# EasyEDA schematic SCH_MusicTheoryLesson-CI-TT_2024-12-17.json
TITLE: Sheet_1; REV: 1.0; Date: 2024-11-09; Sheet: 1/1; Drawn By: akhil.arp2019; Company: Your Company
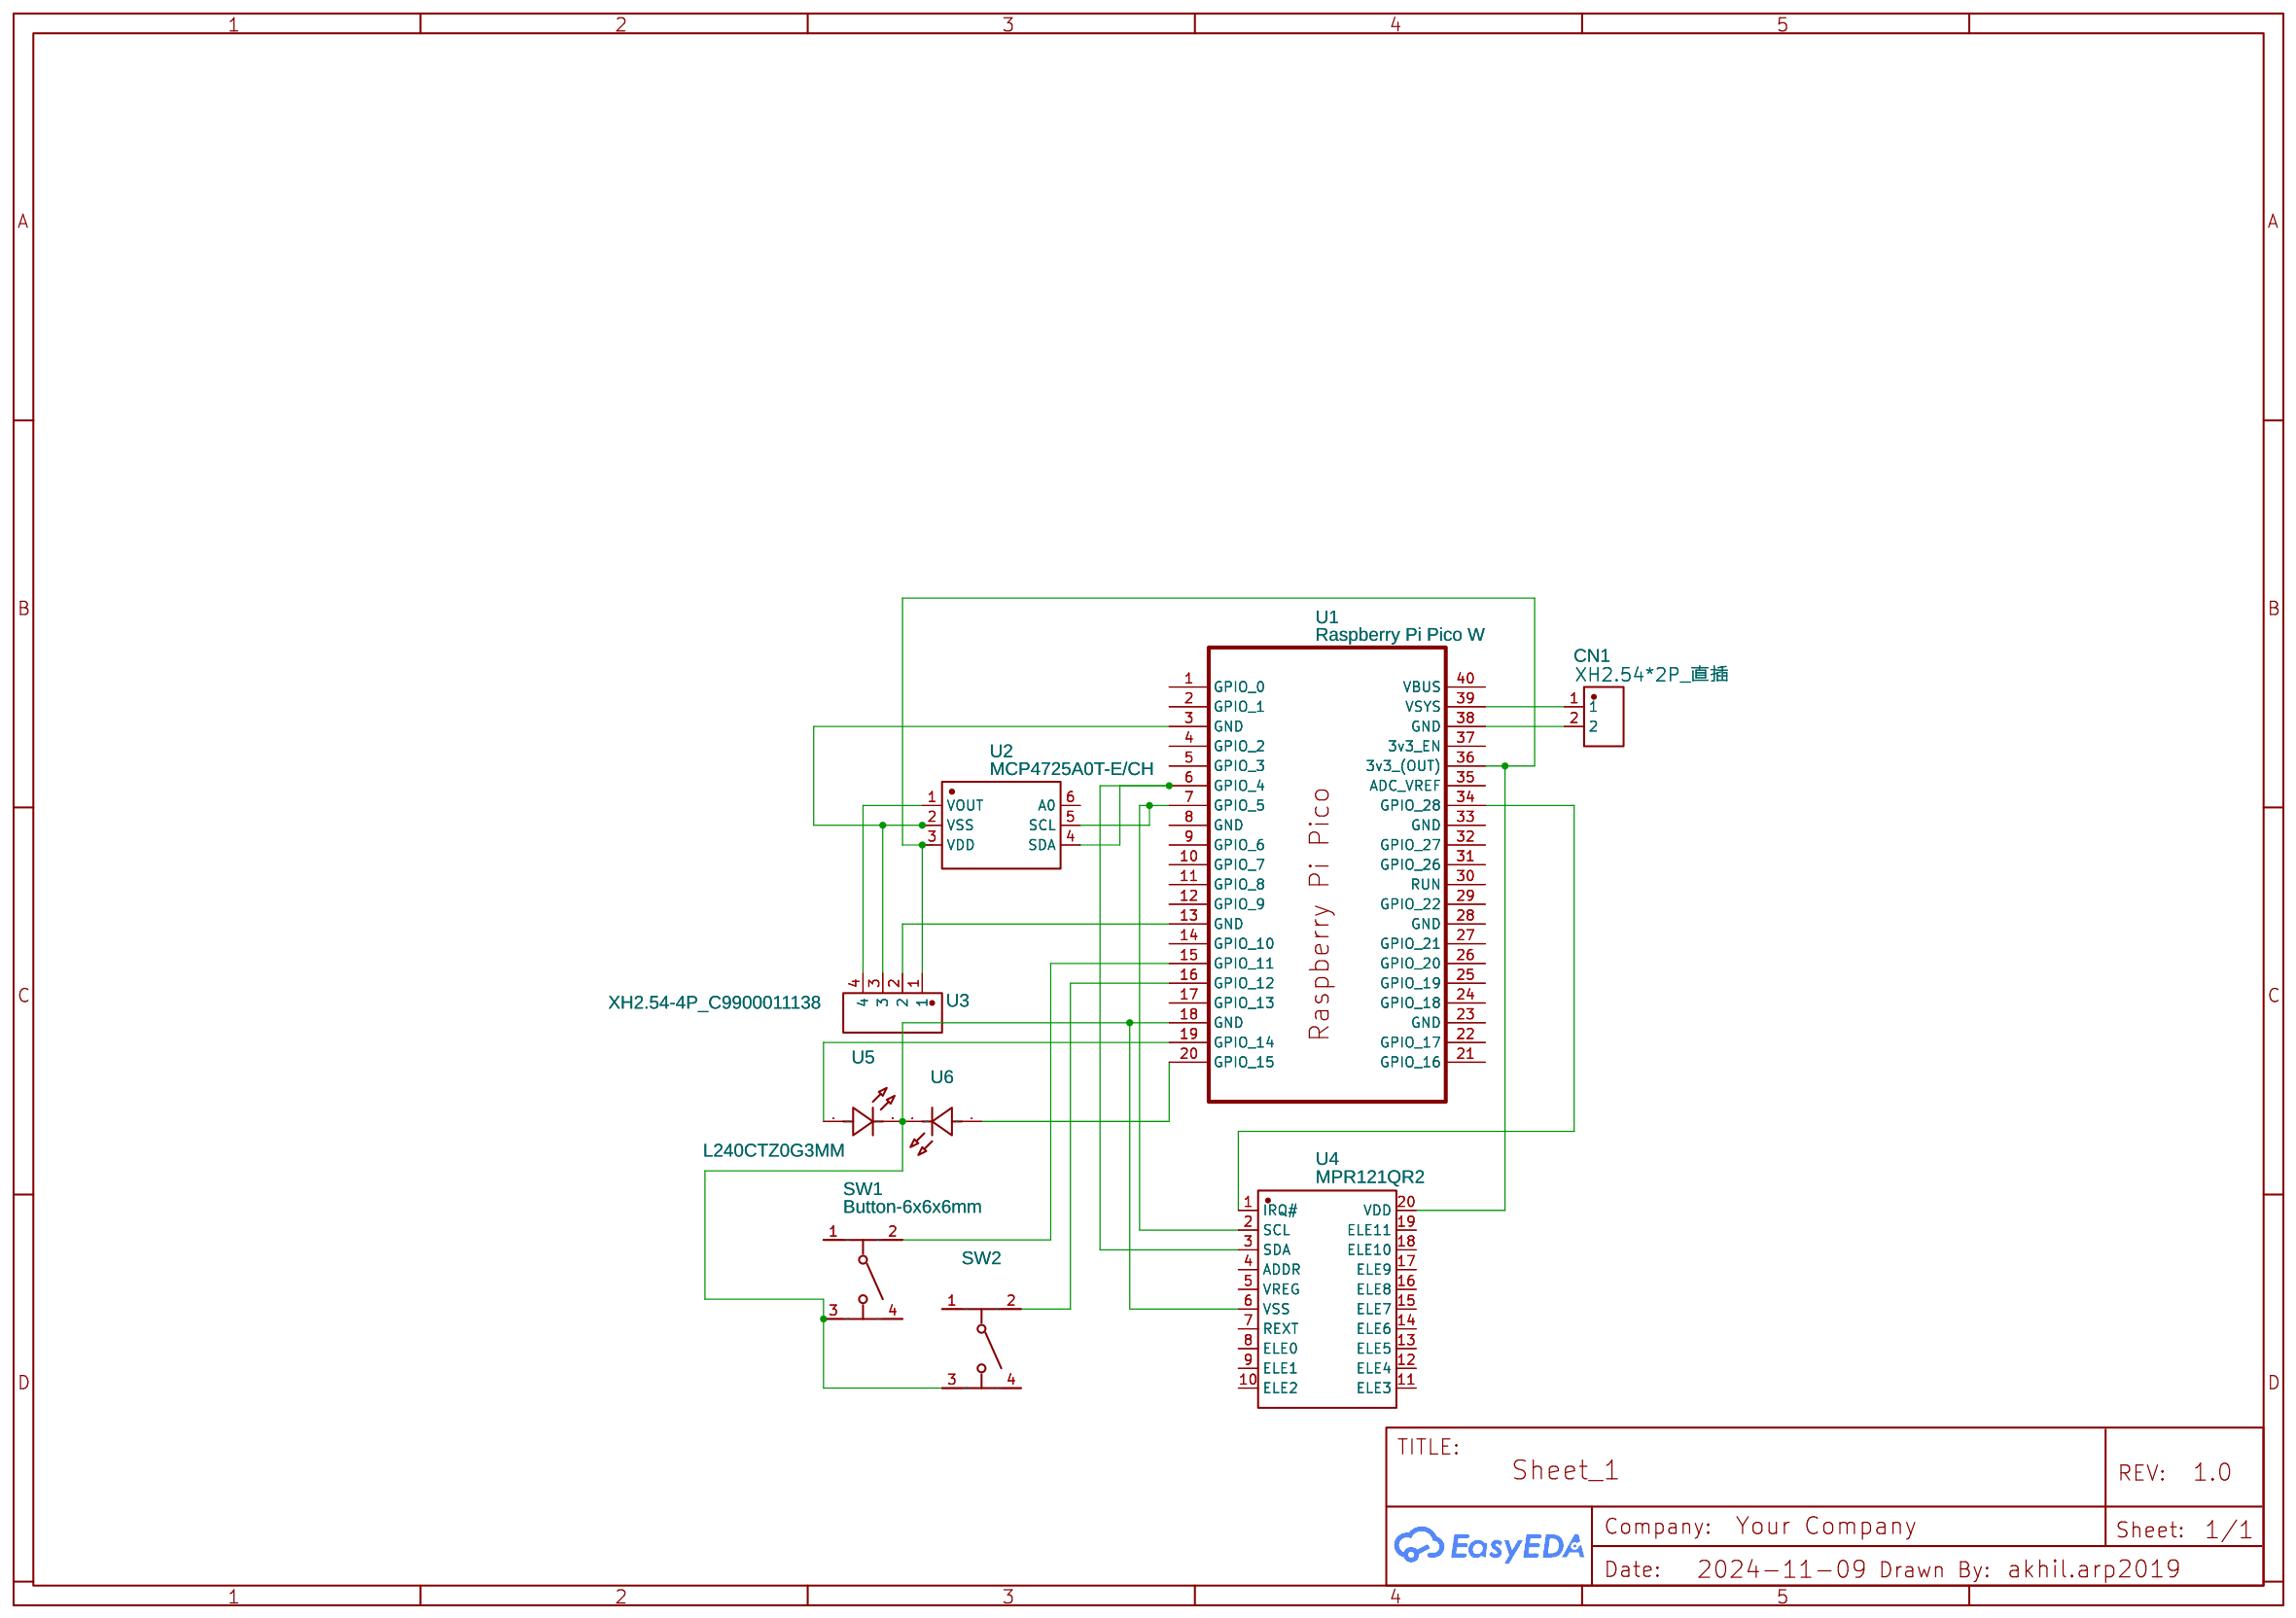
[diagram p0: schematic sheet]

## Parts
CN1  XH2.54*2P_直插  [CONN-TH_2P-P2.50-XH2.54-2P]
SW1  Button-6x6x6mm  [SW-TH_4P-L6.0-W6.0-P4.50-LS6.1]
SW2  Button-6x6x6mm  [SW-TH_4P-L6.0-W6.0-P4.50-LS6.1]
U1  Raspberry Pi Pico W  [RASPBERRY PI PICO/ RASPBERRY PI PICO W]
U2  MCP4725A0T-E/CH  [SOT-23-6_L2.9-W1.6-P0.95-LS2.8-BL]
U3  XH2.54-4P_C9900011138  [CONN-TH_XH2.54-4P]
U4  MPR121QR2  [QFN-20_L3.0-W3.0-P0.40-BL]
U5  L240CTZ0G3MM  [LED-TH_BD3.8-P2.54_L240CTZ0G3MM]
U6  L240CTZ0G3MM  [LED-TH_BD3.8-P2.54_L240CTZ0G3MM]

## Library data of the parts
CN1 = XH2.54*2P_直插: Contributor: LCSC; Supplier: LCSC; Supplier Part: C9900008615; Manufacturer: null; JLCPCB Part Class: Extended Part
SW1 SW2 = Button-6x6x6mm: Supplier Part: C71836; Supplier: LCSC; Manufacturer: BBJ; Manufacturer Part: Switch,6*6*6Plastic head,260G, 0.25mm,Straight line
U1 = Raspberry Pi Pico W: Contributor: benkors
U2 = MCP4725A0T-E/CH: Contributor: LCSC; Supplier: LCSC; Manufacturer: MICROCHIP(美国微芯); Supplier Part: C144198; JLCPCB Part Class: Extended Part
U3 = XH2.54-4P_C9900011138: Contributor: LCSC; Supplier: LCSC; Supplier Part: C9900011138; Manufacturer: null; Manufacturer Part: XH2.54-4P; JLCPCB Part Class: Extended Part
U4 = MPR121QR2: Contributor: LCSC; Supplier: LCSC; Supplier Part: C91322; Manufacturer: NXP(恩智浦); JLCPCB Part Class: Extended Part
U5 U6 = L240CTZ0G3MM: Supplier: LCSC; Supplier Part: C9900093286; Manufacturer: null; Contributor: lcsc; JLCPCB Part Class: Extended Part

## Nets
Net-(CN1-1): CN1.1 U1.39(VSYS)
Net-(CN1-2): CN1.2 U1.38(GND)
Net-(SW1-2): SW1.2 U1.15(GPIO 11)
Net-(SW1-3): SW1.3 SW2.3 U1.18(GND) U4.6(VSS) U5.2(K) U6.2(K)
Net-(SW2-2): SW2.2 U1.16(GPIO 12)
Net-(U1-3): U1.3(GND) U2.2(VSS) U3.3
Net-(U1-6): U1.6(GPIO 4) U2.4(SDA) U4.3(SDA)
Net-(U1-7): U1.7(GPIO 5) U2.5(SCL) U4.2(SCL)
Net-(U1-13): U1.13(GND) U3.2
Net-(U1-19): U1.19(GPIO 14) U5.1(A)
Net-(U1-20): U1.20(GPIO 15) U6.1(A)
Net-(U1-34): U1.34(GPIO 28) U4.1(IRQ#)
Net-(U1-36): U1.36(3v3 (OUT)) U2.3(VDD) U3.1 U4.20(VDD)
Net-(U2-1): U2.1(VOUT) U3.4

Not connected (* = marked no-connect by the designer): SW1 1 4; SW2 1 4; U1 1(GPIO 0) 2(GPIO 1) 4(GPIO 2) 5(GPIO 3) 8(GND) 9(GPIO 6) 10(GPIO 7) 11(GPIO 8) 12(GPIO 9) 14(GPIO 10) 17(GPIO 13) 21(GPIO 16) 22(GPIO 17) 23(GND) 24(GPIO 18) 25(GPIO 19) 26(GPIO 20) 27(GPIO 21) 28(GND) 29(GPIO 22) 30(RUN) 31(GPIO 26) 32(GPIO 27) 33(GND) 35(ADC_VREF) 37(3v3_EN) 40(VBUS); U2 6(A0); U4 4(ADDR) 5(VREG) 7(REXT) 8(ELE0) 9(ELE1) 10(ELE2) 11(ELE3) 12(ELE4) 13(ELE5) 14(ELE6) 15(ELE7) 16(ELE8) 17(ELE9) 18(ELE10) 19(ELE11)
